# Altium schematic sheet VAC_Sense.SchDoc (part 2 of 3)
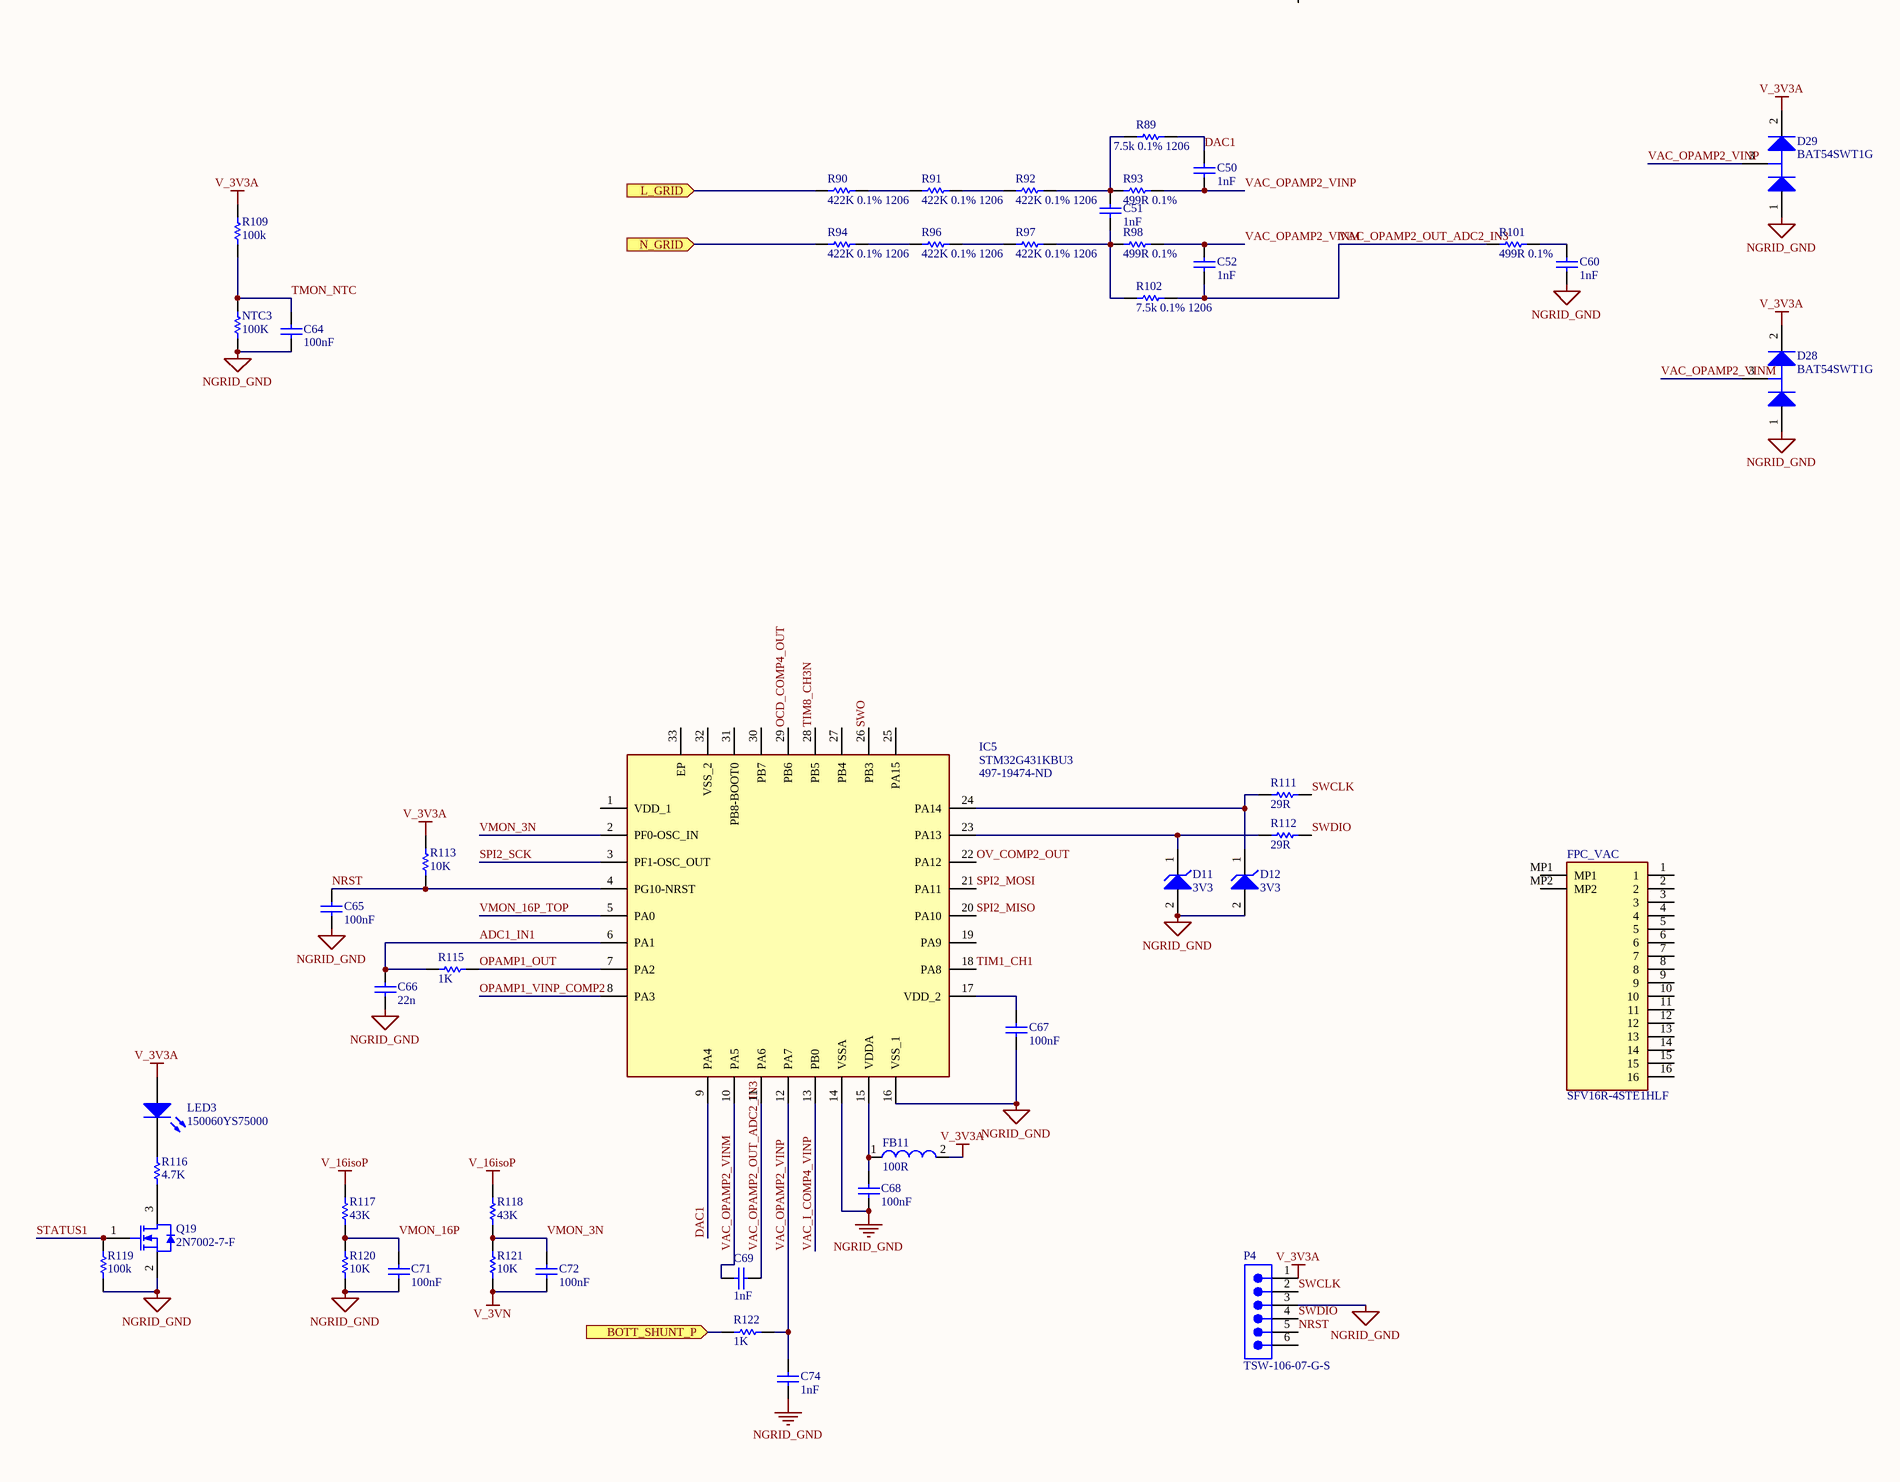
[diagram p2: VAC_Sense.SchDoc, bottom]
## Library data of the parts
C10 = CMP-2007-03234-1: SMD Multilayer Ceramic Capacitor, 1 µF, 25 V, 0805 [2012 Metric], ± 10%, X7R; Part Number: C0805C105K3RACTU; Manufacturer: Kemet; Voltage Rating: 25V; Supplier 1: Digi-Key; Supplier Part Number 1: 399-8004-1-ND; Manufacturer Part Number: C0805C105K3RACTU; RoHS: Yes; Category: Ceramic Capacitors; Stock 1: 73815; Pricing 1: 1=0.14000, 10=0.09900, 50=0.05620, 100=0.04650, 500=0.03262, 1000=0.02700 (USD); Mount: Surface Mount; Case/Package: 0805; Number of Pins: 2; Case Code (Imperial): 0805; Case Code (Metric): 2012; Dielectric Material: Ceramic; Contact Plating: Tin,Matte; Min Operating Temperature: -55°C; Max Operating Temperature: 125°C; Capacitance: 1uF; Tolerance: 10%; Packaging: Tape and Reel; Dielectric: X7R; Package Quantity: 1; Voltage Rating (DC): 25V; Termination: SMD/SMT; Series: C; Construction: Flat; Voltage: 25V; Length: 2mm; Width: 0.049inch; Height: 1.25mm; Depth: 1.25mm; Thickness: 0.055inch; Radiation Hardening: No; RoHS Compliant: Yes; REACH SVHC: No SVHC; ComponentLink1URL: https://datasheet.ciiva.com/6074/kem-c1002-x7r-smd-6074661.pdf?src-supplier=Farnell; ComponentLink1Description: https://datasheet.ciiva.com/6074/kem-c1002-x7r-smd-6074661.pdf?src-supplier=Farnell; ComponentLink2URL: https://datasheet.ciiva.com/28610/1918693-28610874.pdf?src-supplier=Element14; ComponentLink2Description: https://datasheet.ciiva.com/28610/1918693-28610874.pdf?src-supplier=Element14; ComponentLink3URL: https://datasheet.ciiva.com/46443/1851736-46443533.pdf?src-supplier=Element14; ComponentLink3Description: https://datasheet.ciiva.com/46443/1851736-46443533.pdf?src-supplier=Element14
C42 C101 = CMP-2000-06039-1: Chip Capacitor, 4.7 uF, +/- 10%, 25 V, -55 to 125 degC, 0805 (2012 Metric), RoHS, Tape and Reel; Manufacturer: TDK; PCN Part Number: MLCCPartNumberChange30/Nov/2012; Other Names: 445-5972-2C2012X7R1E475KC2012X7R1E475KT000N; Temperature Coefficient: X7R; Voltage - Rated: 25V; Product Training Modules: CSeriesGeneralApplicationsSEAT,CCV,andTVCLDesignToolsGuidetoReplacinganElectrolyticCapacitorwithanMLCC; Catalog Drawings: CSERIES_2012-0805_1.45; Online Catalog: CSeries,GeneralPurpose; Capacitance: 4.7µF; Package Description: 2-Pin Surface Mount Device, Body 2 x 1.25 mm; Manufacturer URL: http://www.tdk.com/; Features: -; Family: CeramicCapacitors; Applications: GeneralPurpose; Standard Package: 2,000; RoHS Information: RoHSCertificate-MLCC; Operating Temperature: -55°C~125°C; Lead Spacing: -; Lead Style: -; Datasheet Version: 01/2016; Datasheet URL: https://product.tdk.com/info/en/documents/chara_sheet/C2012X7R1E475K125AB.pdf; Series: C; Package Reference: 0805; Category: Capacitors; Ratings: -; Packaging: Tape&Reel(TR); Tolerance: ±10%; Height - Seated (Max): -; Size / Dimension: 0.079"Lx0.049"W(2.00mmx1.25mm); Package / Case: 0805(2012Metric); Mounting Technology: SurfaceMount; Mounting Type: SurfaceMount,MLCC; Thickness (Max): 0.057"(1.45mm)
C43 = CMP-2000-05863-1: Chip Capacitor, 10 uF, +/- 10%, 25 V, -55 to 85 degC, 1206 (3216 Metric), RoHS, Tape and Reel; Manufacturer: AVX; Dielectric: X5R; Capacitance: 10µF; Mounting Technology: SurfaceMount; Package Reference: 1206; Tolerance (%): ±10%; Manufacturer URL: http://www.avx.com/; Rated Voltage: 25V; Datasheet URL: http://datasheets.avx.com/cx5r.pdf; Package Description: 2-Pin Surface Mount Device, Body 3.2 x 1.6 mm; Datasheet Version: 05/2016; Case Size/Dimension: 1206
C50-C60 C64 C65 C69 C71 C72 C74 = CMP-2006-04245-1: Manufacturer: AVX Interconnect / Elco; Part Number: 06035A151JAT2A.; Manufacturer Part Number: 06035A151JAT2A; Dielectric Material: Ceramic; Capacitance: 100pF; Tolerance: 5%; Voltage Rating (DC): 50V; Dielectric: C0G; Temperature Coefficient: 30ppm/°C; Insulation Resistance: 100GR; Supplier 1: Digi-Key; Supplier Part Number 1: 478-1177-1-ND; RoHS: Yes; Category: Ceramic Capacitors; Stock 1: 63714; Pricing 1: 1=0.12000, 10=0.08900, 100=0.04180, 500=0.02932, 1000=0.02428 (USD); Mount: Surface Mount,PCB; Case/Package: 0603; Number of Pins: 2; Case Code (Metric): 1608; Case Code (Imperial): 0603; Contact Plating: Tin,Matte; Min Operating Temperature: -55°C; Max Operating Temperature: 125°C; Voltage Rating: 50V; Packaging: Tape and Reel; Package Quantity: 1; Termination: SMD/SMT; Voltage: 50V; Length: 1.6mm; Height: 0.86mm; Width: 0.032inch; Depth: 0.81mm; Thickness: 0.035inch; Radiation Hardening: No; Lead Free: Lead Free; REACH SVHC: No SVHC; ComponentLink1URL: https://datasheet.ciiva.com/1124/84496-1124721.pdf?src-supplier=Element14; ComponentLink1Description: https://datasheet.ciiva.com/1124/84496-1124721.pdf?src-supplier=Element14; ComponentLink2URL: https://datasheet.ciiva.com/2987/ccog-2987781.pdf?src-supplier=Avnet; ComponentLink2Description: https://datasheet.ciiva.com/2987/ccog-2987781.pdf?src-supplier=Avnet; ComponentLink3URL: https://datasheet.ciiva.com/7855/759117-7855061.pdf?src-supplier=Element14; ComponentLink3Description: https://datasheet.ciiva.com/7855/759117-7855061.pdf?src-supplier=Element14; ComponentLink4URL: https://datasheet.ciiva.com/2987/ccog-2987782.pdf?src-supplier=Avnet; ComponentLink4Description: https://datasheet.ciiva.com/2987/ccog-2987782.pdf?src-supplier=Avnet; ComponentLink5URL: https://datasheet.ciiva.com/156/ccog-156216.pdf?src-supplier=Digi-Key; ComponentLink5Description: https://datasheet.ciiva.com/156/ccog-156216.pdf?src-supplier=Digi-Key; ComponentLink6URL: https://datasheet.ciiva.com/156/ccog-156217.pdf?src-supplier=Digi-Key; ComponentLink6Description: https://datasheet.ciiva.com/156/ccog-156217.pdf?src-supplier=Digi-Key; ComponentLink7URL: https://datasheet.ciiva.com/156/ccog-156218.pdf?src-supplier=Digi-Key; ComponentLink7Description: https://datasheet.ciiva.com/156/ccog-156218.pdf?src-supplier=Digi-Key; ComponentLink8URL: https://datasheet.ciiva.com/16300/ccog-16300429.pdf?src-supplier=Future+Electronics; ComponentLink8Description: https://datasheet.ciiva.com/16300/ccog-16300429.pdf?src-supplier=Future+Electronics; ComponentLink9URL: https://datasheet.ciiva.com/22699/84496-22699966.pdf?src-supplier=Element14; ComponentLink9Description: https://datasheet.ciiva.com/22699/84496-22699966.pdf?src-supplier=Element14; ComponentLink10URL: https://datasheet.ciiva.com/5418/ccog-5418335.pdf?src-supplier=Mouser; ComponentLink10Description: https://datasheet.ciiva.com/5418/ccog-5418335.pdf?src-supplier=Mouser; ComponentLink11URL: https://datasheet.ciiva.com/16538/ccog-16538111.pdf?src-supplier=Avnet+Asia; ComponentLink11Description: https://datasheet.ciiva.com/16538/ccog-16538111.pdf?src-supplier=Avnet+Asia
C66 C75 = CMP-2100-03644-1: Chip Capacitor, 0.1 uF, +/- 10%, 50 V, -55 to 125 degC, 0805 (2012 Metric), RoHS, Tape and Reel; Manufacturer: Murata; Manufacturer Part Number: GRM21BR71H104KA01L; Voltage: 50V; Capacitance: 100nF; Insulation Resistance: 10GR; Dielectric Material: Ceramic; Dielectric: X7R; Package Description: 2-Pin Surface Mount Device, Body 2 x 1.25 mm; Manufacturer URL: http://www.murata.com/; Case Code (Imperial): 0805; Datasheet URL: http://psearch.en.murata.com/capacitor/product/GRM21BR71H104KA01%23.pdf; Termination: SMD/SMT; Lead Free: LeadFree; Package Quantity: 1; Mount: SurfaceMount; REACH SVHC: Unknown; Thickness: 0.053inch; Height: 1.25mm; Case/Package: 0805; Voltage Rating: 50V; Width: 0.049inch; Case Code (Metric): 2012; Material: Ceramic; Min Operating Temperature: -55degC; RoHSCompliant: true; Datasheet Version: 42675.0; Voltage Rating (DC): 50V; Tolerance: 10%; Package Reference: 0805; Depth: 1.25mm; Length: 2mm; Max Operating Temperature: 125degC; Packaging: TapeandReel; Number of Pins: 2; Radiation Hardening: No; Supplier 1: Farnell; Supplier Part Number 1: 2408531; RoHS: Yes; Category: Ceramic Capacitors; ComponentLink1URL: https://datasheet.ciiva.com/11786/0900766b8003061f-11786305.pdf?src-supplier=RSComponents; ComponentLink1Description: https://datasheet.ciiva.com/11786/0900766b8003061f-11786305.pdf?src-supplier=RSComponents; ComponentLink2URL: https://datasheet.ciiva.com/20173/71-2024-20173169.pdf?src-supplier=Rapid+Electronics; ComponentLink2Description: https://datasheet.ciiva.com/20173/71-2024-20173169.pdf?src-supplier=Rapid+Electronics; ComponentLink3URL: https://datasheet.ciiva.com/29200/453120-da-01-en-vs-kondensator-0805-29200537.pdf?src-supplier=Conrad; ComponentLink3Description: https://datasheet.ciiva.com/29200/453120-da-01-en-vs-kondensator-0805-29200537.pdf?src-supplier=Conrad; ComponentLink4URL: https://datasheet.ciiva.com/132/partnumbering-e-01-132209.pdf?src-supplier=Digi-Key; ComponentLink4Description: https://datasheet.ciiva.com/132/partnumbering-e-01-132209.pdf?src-supplier=Digi-Key; ComponentLink5URL: https://datasheet.ciiva.com/132/partnumbering-e-01-132210.pdf?src-supplier=Digi-Key; ComponentLink5Description: https://datasheet.ciiva.com/132/partnumbering-e-01-132210.pdf?src-supplier=Digi-Key; ComponentLink6URL: https://datasheet.ciiva.com/132/partnumbering-e-01-132211.pdf?src-supplier=Digi-Key; ComponentLink6Description: https://datasheet.ciiva.com/132/partnumbering-e-01-132211.pdf?src-supplier=Digi-Key; ComponentLink7URL: https://datasheet.ciiva.com/7937/1794405-7937708.pdf?src-supplier=Element14; ComponentLink7Description: https://datasheet.ciiva.com/7937/1794405-7937708.pdf?src-supplier=Element14; ComponentLink8URL: https://datasheet.ciiva.com/7937/1794405-7937709.pdf?src-supplier=Element14; ComponentLink8Description: https://datasheet.ciiva.com/7937/1794405-7937709.pdf?src-supplier=Element14; ComponentLink9URL: https://datasheet.ciiva.com/28534/1769893-28534317.pdf?src-supplier=Element14; ComponentLink9Description: https://datasheet.ciiva.com/28534/1769893-28534317.pdf?src-supplier=Element14; ComponentLink10URL: https://datasheet.ciiva.com/7937/4360-7937710.pdf?src-supplier=Element14; ComponentLink10Description: https://datasheet.ciiva.com/7937/4360-7937710.pdf?src-supplier=Element14
  C66: Stock 1: 555000
  C75: Stock 1: 576000
C67 C68 C87-C89 C100 = CMP-2000-05332-1: Cap Ceramic 0.1uF 50VDC X7R 10% SMD 0603 Paper T/R; Manufacturer: Samsung Electro-Mechanics; Manufacturer Part Number: CL10B104KB8NNNC; Capacitance: 0.1µF; Rated Voltage: 50V; Case Size/Dimension: 0603; Datasheet URL: https://datasheet.ciiva.com/29198/456651-da-01-en-vs-kondensator-0605-29198839.pdf; Manufacturer URL: http://www.samsungsem.com/global/index.jsp; Dielectric: X7R; Tolerance (%): ±10%; Datasheet Version: Nov-10; Supplier 1: Digi-Key; Supplier Part Number 1: 1276-1000-1-ND; RoHS: Yes; Category: Ceramic Capacitors; Stock 1: 13409690; Pricing 1: 1=0.10000, 10=0.03000, 50=0.01620, 100=0.01330, 500=0.00950, 1000=0.00746 (USD); Mount: Surface Mount; Case/Package: 0603; Case Code (Metric): 1608; Case Code (Imperial): 0603; Contact Plating: Tin; Material: Ceramic; Min Operating Temperature: -55°C; Max Operating Temperature: 125°C; Voltage Rating: 50V; Package Quantity: 1; Packaging: Tape and Reel; Tolerance: 10%; Voltage Rating (DC): 50V; Voltage: 50V; Series: CL; Construction: Flat; Length: 1.6mm; Width: 0.031inch; Height: 0.8mm; Depth: 0.8mm; Thickness: 0.035inch; Radiation Hardening: No; Lead Free: Lead Free; RoHS Compliant: Yes; ComponentLink1URL: https://datasheet.ciiva.com/25803/cl10b104kb8nnnc-25803393.pdf?src-supplier=Digi-Key; ComponentLink1Description: https://datasheet.ciiva.com/25803/cl10b104kb8nnnc-25803393.pdf?src-supplier=Digi-Key; ComponentLink2URL: https://datasheet.ciiva.com/26838/getdatasheetpartid-89097-26838411.pdf?src-supplier=Verical; ComponentLink2Description: https://datasheet.ciiva.com/26838/getdatasheetpartid-89097-26838411.pdf?src-supplier=Verical; ComponentLink3URL: https://datasheet.ciiva.com/29198/456651-da-01-en-vs-kondensator-0605-29198839.pdf?src-supplier=Conrad; ComponentLink3Description: https://datasheet.ciiva.com/29198/456651-da-01-en-vs-kondensator-0605-29198839.pdf?src-supplier=Conrad
C73 = CMP-2006-02595-1: 0603 100pF 50V ±5 % Tolerance C0G SMT Multilayer Ceramic Capacitor; Part Number: GRM1885C1H101JA01D; Manufacturer: Murata; Tolerance: 5%; Temperature Coefficient: 30ppm/°C; Insulation Resistance: 10GR; Supplier 1: Digi-Key; Supplier Part Number 1: 490-1427-1-ND; Manufacturer Part Number: GRM1885C1H101JA01D; RoHS: Yes; Category: Ceramic Capacitors; Stock 1: 416176; Pricing 1: 1=0.10000, 10=0.06100, 50=0.03320, 100=0.02700, 500=0.01932, 1000=0.01518 (USD); Mount: Surface Mount; Case/Package: 0603; Number of Pins: 2; Case Code (Metric): 1608; Case Code (Imperial): 0603; Dielectric Material: Ceramic; Material: Ceramic; Weight: 7.1E-05oz; Min Operating Temperature: -55°C; Max Operating Temperature: 125°C; Capacitance: 100pF; Voltage Rating: 50V; Packaging: Tape and Reel; Package Quantity: 1; Voltage Rating (DC): 50V; Dielectric: C0G; Termination: SMD/SMT; Voltage: 50V; Length: 1.6mm; Width: 0.031inch; Height: 0.8mm; Thickness: 0.035inch; Depth: 0.8mm; Radiation Hardening: No; REACH SVHC: Unknown; RoHS Compliant: Yes; Lead Free: Lead Free; ComponentLink1URL: https://datasheet.ciiva.com/131/product-131088.pdf?src-supplier=Digi-Key; ComponentLink1Description: https://datasheet.ciiva.com/131/product-131088.pdf?src-supplier=Digi-Key; ComponentLink2URL: https://datasheet.ciiva.com/18100/getdatasheetpartid-26823-18100641.pdf?src-supplier=Verical; ComponentLink2Description: https://datasheet.ciiva.com/18100/getdatasheetpartid-26823-18100641.pdf?src-supplier=Verical; ComponentLink3URL: https://datasheet.ciiva.com/3777/grm1885c1h101ja0123-3777264.pdf?src-supplier=Arrow+Electronics; ComponentLink3Description: https://datasheet.ciiva.com/3777/grm1885c1h101ja0123-3777264.pdf?src-supplier=Arrow+Electronics; ComponentLink4URL: https://datasheet.ciiva.com/29149/450134-da-01-en-vs-kondensator-0603-29149008.pdf?src-supplier=Conrad; ComponentLink4Description: https://datasheet.ciiva.com/29149/450134-da-01-en-vs-kondensator-0603-29149008.pdf?src-supplier=Conrad; ComponentLink5URL: https://datasheet.ciiva.com/131/partnumbering-e-01-131089.pdf?src-supplier=Digi-Key; ComponentLink5Description: https://datasheet.ciiva.com/131/partnumbering-e-01-131089.pdf?src-supplier=Digi-Key; ComponentLink6URL: https://datasheet.ciiva.com/11605/c02e-11605557.pdf?src-supplier=Avnet; ComponentLink6Description: https://datasheet.ciiva.com/11605/c02e-11605557.pdf?src-supplier=Avnet; ComponentLink7URL: https://datasheet.ciiva.com/28556/4360-28556551.pdf?src-supplier=Element14; ComponentLink7Description: https://datasheet.ciiva.com/28556/4360-28556551.pdf?src-supplier=Element14; ComponentLink8URL: https://datasheet.ciiva.com/7828/4360-7828889.pdf?src-supplier=Element14; ComponentLink8Description: https://datasheet.ciiva.com/7828/4360-7828889.pdf?src-supplier=Element14; ComponentLink9URL: https://datasheet.ciiva.com/7828/4360-7828890.pdf?src-supplier=Element14; ComponentLink9Description: https://datasheet.ciiva.com/7828/4360-7828890.pdf?src-supplier=Element14; ComponentLink10URL: https://datasheet.ciiva.com/7828/4360-7828891.pdf?src-supplier=Element14; ComponentLink10Description: https://datasheet.ciiva.com/7828/4360-7828891.pdf?src-supplier=Element14; ComponentLink11URL: https://datasheet.ciiva.com/14116/grmseries-tc-hitype-eng-14116828.pdf?src-supplier=Distrelec; ComponentLink11Description: https://datasheet.ciiva.com/14116/grmseries-tc-hitype-eng-14116828.pdf?src-supplier=Distrelec; ComponentLink12URL: https://datasheet.ciiva.com/16291/product-16291613.pdf?src-supplier=Future+Electronics; ComponentLink12Description: https://datasheet.ciiva.com/16291/product-16291613.pdf?src-supplier=Future+Electronics; ComponentLink13URL: https://datasheet.ciiva.com/131/partnumbering-e-01-131087.pdf?src-supplier=Digi-Key; ComponentLink13Description: https://datasheet.ciiva.com/131/partnumbering-e-01-131087.pdf?src-supplier=Digi-Key; ComponentLink14URL: https://datasheet.ciiva.com/14116/grmseries-tc-hitype-eng-14116815.pdf?src-supplier=Distrelec; ComponentLink14Description: https://datasheet.ciiva.com/14116/grmseries-tc-hitype-eng-14116815.pdf?src-supplier=Distrelec
D11 D12 = CMP-1063-00098-1: Transient Voltage Suppressor, Micro-Packaged Diode for ESD Protection, 2-Pin SOD-523, Pb-Free, Tape and Reel; Manufacturer: On Semiconductor; PartNumber: ESD5Z3.3T1G; VRWM Max (V): 3.3; Number of Lines: 1; V(BR) Min (V): 5; PPK Max (W): 158; Direction: Unidirectional; IR Max (uA): 0.05; PackageReference: SOD-523-2-502-01; PackageVersion: Rev. E, 09/2010; RoHS: Pb-Free; ComponentLink3Description: Package Specification; Packing: Tape and Reel; ComponentLink1URL: http://www.onsemi.com/; DatasheetVersion: Rev. 10; ComponentLink2Description: Datasheet; Mounting Technology: Surface Mount; ComponentLink2URL: http://www.onsemi.cn/pub_link/Collateral/ESD5Z2.5T1-D.PDF; PackageDescription: 2-Pin SOD, Body 1.2 x 0.8 mm; ComponentLink3URL: http://www.onsemi.com/pub_link/Collateral/502-01.PDF; ComponentLink1Description: Manufacturer URL
D25 D28 D29 = CMP-1055-00559-1: Dual Series Schottky Barrier Diodes, 3-Pin SOT-323, Pb-Free, Tape and Reel; Manufacturer: On Semiconductor; trr Max (ns): 5; IFSM Max (A): 0.6; ComponentLink1URL: http://www.onsemi.com/; Mounting Technology: Surface Mount; ComponentLink1Description: Manufacturer URL; ComponentLink3URL: http://www.onsemi.com/pub_link/Collateral/419-04.PDF; RoHS: TRUE; PackageVersion: Rev. N, 11/2008; Packing: Tape and Reel; PackageReference: SOT-323-3-419-04; ComponentLink2URL: http://www.onsemi.cn/pub_link/Collateral/BAT54SWT1-D.PDF; ComponentLink3Description: Package Specification; PackageDescription: 3-Pin Small Outline Transistor, Body 2 x 1.25 mm, Pitch 0.65 mm; ComponentLink2Description: Datasheet; PartNumber: BAT54SWT1G; DatasheetVersion: Rev. 10; Configuration: Dual
FB3-FB5 FB11 FB13 = CMP-0220-00115-1: SMD EMI Suppression Ferrite Bead WE-CBF, Z = 1500 Ohm; DatasheetVersion: Dec-2005; ComponentLink1URL: http://www.we-online.com; PackageVersion: 2009; PackageDescription: Chip Inductor, 2-Leads, Body 1.6 x 0.8 mm; ComponentLink2URL: http://www.we-online.de/katalog/media/pdf/742792691.pdf; ComponentLink1Description: Manufacturer Link; ComponentLink2Description: Datasheet; Impedance: 1500 Ohm; PackageReference: SMD-0603
FPC_VAC = SFV16R-4STE1HLF: Connector; Manufacturer_Name: Amphenol; Datasheet Link: https://cdn.amphenol-icc.com/media/wysiwyg/files/documentation/gs-12-645.pdf; Height: 2mm; Manufacturer_Part_Number: SFV16R-4STE1HLF; Mouser Part Number: 649-SFV16R-4STE1HLF; Mouser Price/Stock: https://www.mouser.com/Search/Refine.aspx?Keyword=649-SFV16R-4STE1HLF
IC4 = MIC2290YML_TR: Integrated Circuit; Manufacturer_Name: Microchip; Manufacturer_Part_Number: MIC2290YML TR; Datasheet Link: http://ww1.microchip.com/downloads/en/DeviceDoc/mic2290.pdf; Height: 0.95mm; Arrow Part Number: MIC2290YML TR; Arrow Price/Stock: https://www.arrow.com/en/products/mic2290yml-tr/microchip-technology
IC5 = STM32G431KBU3: Microcontroller 32-Bit ARM Cortex-M4 RISC 128KB Flash 1.71V to 3.6V 32-Pin UFQFPN; Manufacturer_Name: STMicroelectronics; Manufacturer Part Number: STM32G431KBU6; Datasheet Link: https://componentsearchengine.com/Datasheets/1/STM32G431KBU3.pdf; Height: 0.6mm; Manufacturer_Part_Number: STM32G431KBU3; Mouser Part Number: 511-STM32G431KBU3; Mouser Price/Stock: https://www.mouser.co.uk/ProductDetail/STMicroelectronics/STM32G431KBU3?qs=PzGy0jfpSMtowkKWTRQBRw%3D%3D; Arrow Part Number: STM32G431KBU3; Arrow Price/Stock: https://www.arrow.com/en/products/stm32g431kbu3/stmicroelectronics; Supplier 1: Digi-Key; Manufacturer: STMicroelectronics; RoHS: No; Category: Microcontrollers; Stock 1: 293; Pricing 1: 1=5.78000, 10=5.18800, 25=4.90440, 80=4.25038, 230=4.03239, 490=3.61827, 980=3.17870 (USD)
L4 = CMP-0007-00012-1: Semi-shielded Power Inductor, 15 uH, +/- 20%, 0.8 A, -40 to 125 degC, 3 x 3 x 1.5 mm SMD, RoHS and Halogen Free, Tape and Reel; Manufacturer: Bourns; Isat: 0.68 A; Resistance to Solder Heat: +260 degC for 10 sec.; Inductance tolerance: +/- 20%; Rated current: 0.8 A; DCR Max: 0.422 Ohm; SRF Min: 33 MHz; Inductance: 15 uH; Core Material: Ferrite; Material: Steel; Max DC Current: 800mA; DC Resistance (DCR): 422mR; Self Resonant Frequency: 33MHz; Saturation Current: 680mA; Test Frequency: 1MHz; ComponentLink3Description: Package Specification; ComponentLink2URL: http://www.bourns.com/data/global/pdfs/SRN3015.pdf; Mounting Technology: Surface Mount; Operating Temperature: -40 to 125 degC; PartNumber: SRN3015-150M; ComponentLink1URL: http://www.bourns.com/; PackageReference: SRN3015; ComponentLink1Description: Manufacturer URL; PackageDescription: 2-Pin SMD, Body 3 x 3 mm, Height 1.5 mm; Packing: Tape and Reel; RoHS: TRUE; ComponentLink2Description: Datasheet; DatasheetVersion: Aug-11; ComponentLink3URL: http://www.bourns.com/data/global/pdfs/SRN3015.pdf; Supplier 1: Digi-Key; Supplier Part Number 1: SRN3015-150MCT-ND; Manufacturer Part Number: SRN3015-150M; Category: Fixed Inductors; Stock 1: 84; Pricing 1: 1=0.49000, 10=0.42400, 25=0.39400, 50=0.33360, 100=0.30320, 250=0.28500, 500=0.25468, 1000=0.20617 (USD); Case/Package: 1212; Number of Pins: 2; Weight: 0.001235oz; Min Operating Temperature: -40°C; Max Operating Temperature: 125°C; Package Quantity: 2000; Packaging: Tape and Reel; Termination: SMD/SMT; Tolerance: 20%; Shielding: Shielded; Current Rating: 800mA; Series: SRN3015; RMS Current (Irms): 800mA; Resistor Type: Wirewound; DC Current: 800mA; Frequency: 33MHz; Sample Rate (Hz): 1MHz; Length: 3mm; Width: 3mm; Height: 1.5mm; Height - Seated (Max): 0.059inch; Depth: 3.1mm; REACH SVHC: No SVHC; RoHS Compliant: Yes; Military Standard: Not; ComponentLink4URL: https://datasheet.ciiva.com/11802/0900766b80fe1f40-11802572.pdf?src-supplier=RSComponents; ComponentLink4Description: https://datasheet.ciiva.com/11802/0900766b80fe1f40-11802572.pdf?src-supplier=RSComponents; ComponentLink5URL: https://datasheet.ciiva.com/7849/1481208-7849509.pdf?src-supplier=Element14; ComponentLink5Description: https://datasheet.ciiva.com/7849/1481208-7849509.pdf?src-supplier=Element14; ComponentLink6URL: https://datasheet.ciiva.com/30224/587srn3015-30224969.pdf?src-supplier=Onlinecomponents.com; ComponentLink6Description: https://datasheet.ciiva.com/30224/587srn3015-30224969.pdf?src-supplier=Onlinecomponents.com; ComponentLink7URL: https://datasheet.ciiva.com/1048/srn3015-1048842.pdf?src-supplier=Digi-Key; ComponentLink7Description: https://datasheet.ciiva.com/1048/srn3015-1048842.pdf?src-supplier=Digi-Key; ComponentLink8URL: https://datasheet.ciiva.com/1048/srn3015-1048843.pdf?src-supplier=Digi-Key; ComponentLink8Description: https://datasheet.ciiva.com/1048/srn3015-1048843.pdf?src-supplier=Digi-Key; ComponentLink9URL: https://datasheet.ciiva.com/5986/1481208-5986171.pdf?src-supplier=Farnell; ComponentLink9Description: https://datasheet.ciiva.com/5986/1481208-5986171.pdf?src-supplier=Farnell; ComponentLink10URL: https://datasheet.ciiva.com/1048/srn3015-1048844.pdf?src-supplier=Digi-Key; ComponentLink10Description: https://datasheet.ciiva.com/1048/srn3015-1048844.pdf?src-supplier=Digi-Key; ComponentLink11URL: https://datasheet.ciiva.com/8515/srn3015-8515454.pdf?src-supplier=Avnet; ComponentLink11Description: https://datasheet.ciiva.com/8515/srn3015-8515454.pdf?src-supplier=Avnet; ComponentLink12URL: https://datasheet.ciiva.com/28678/1481208-28678223.pdf?src-supplier=Element14; ComponentLink12Description: https://datasheet.ciiva.com/28678/1481208-28678223.pdf?src-supplier=Element14
LED3 = CMP-1426-00005-1: SMD mono-color Chip LED, WL-SMCW, Yellow; Manufacturer: Wuerth Elektronik; Dominant Wavelength: 590nm; Viewing Angle: 140°; Lens Style: Clear,Rectangular; Luminous Intensity: 120mcd; Forward Voltage: 2V; Forward Current: 30mA; Test Current: 20mA; ComponentLink1URL: http://www.we-online.com; PartNumber: 150060YS75000; Color: Yellow; ComponentLink2Description: Datasheet; ComponentLink2URL: http://katalog.we-online.com/led/datasheet/150060YS75000.pdf; ComponentLink1Description: Manufacturer URL; PackageReference: 0603_A; Supplier 1: Digi-Key; Supplier Part Number 1: 732-4981-1-ND; Manufacturer Part Number: 150060YS75000; RoHS: Yes; Category: LEDs; Stock 1: 139; Pricing 1: 1=0.14000, 50=0.13300, 100=0.11400, 500=0.09900 (USD); Mount: Surface Mount; Case/Package: 0603; Case Code (Imperial): 0603; Case Code (Metric): 1608; Min Operating Temperature: -40°C; Max Operating Temperature: 85°C; Packaging: Tape and Reel; Package Quantity: 4000; Wavelength: 590nm; Length: 1.6mm; Height: 0.7mm; Width: 0.8mm; REACH SVHC: Unknown; ComponentLink3URL: https://datasheet.ciiva.com/23843/150060ys75000-23843250.pdf?src-supplier=Newark; ComponentLink3Description: https://datasheet.ciiva.com/23843/150060ys75000-23843250.pdf?src-supplier=Newark; ComponentLink4URL: https://datasheet.ciiva.com/29279/759432-da-01-en-chipled-0603-w-kl-gelb-150060ys75000-29279206.pdf?src-supplier=Conrad; ComponentLink4Description: https://datasheet.ciiva.com/29279/759432-da-01-en-chipled-0603-w-kl-gelb-150060ys75000-29279206.pdf?src-supplier=Conrad; ComponentLink5URL: https://datasheet.ciiva.com/29563/150060ys75000-29563045.pdf?src-supplier=Digi-Key; ComponentLink5Description: https://datasheet.ciiva.com/29563/150060ys75000-29563045.pdf?src-supplier=Digi-Key; ComponentLink6URL: https://datasheet.ciiva.com/22656/1911348-22656951.pdf?src-supplier=Element14; ComponentLink6Description: https://datasheet.ciiva.com/22656/1911348-22656951.pdf?src-supplier=Element14; ComponentLink7URL: https://datasheet.ciiva.com/29563/150060ys75000-29563033.pdf?src-supplier=Digi-Key; ComponentLink7Description: https://datasheet.ciiva.com/29563/150060ys75000-29563033.pdf?src-supplier=Digi-Key; ComponentLink8URL: https://datasheet.ciiva.com/48430/150060ys75000-eng-tds-48430044.pdf?src-supplier=Distrelec; ComponentLink8Description: https://datasheet.ciiva.com/48430/150060ys75000-eng-tds-48430044.pdf?src-supplier=Distrelec
NTC3 = CMP-2000-03662-1: Manufacturer: Vishay Dale; Part Number: NTHS0603N01N1003JE
P4 = CMP-1024-00383-1: 0.025" SQ Post Header, Through-hole, Vertical, -55 to 125 degC, 2.54 mm Pitch, 6-Pin, Male, RoHS; Manufacturer: Samtec; Pitch: 2.54 mm; RoHS: True; ComponentLink1Description: Manufacturer URL; DatasheetVersion: F-214; Orientation: Vertical; ComponentLink1URL: http://www.samtec.com; ComponentLink3Description: Package Specification; ComponentLink2Description: Datasheet; PackageVersion: DM, 8/1988; PackageDescription: .025[0.64] SQ. Post Terminal Strip Assembly; PackageReference: TSW-106-07-X-S; Mounting Technology: Through-hole; Temperature Range: -55 to 125 degC; ComponentLink3URL: http://www.samtec.com/documents/webfiles/cpdf/TSW-XXX-XX-XXX-X-XX-XXX-MKT.pdf; ComponentLink2URL: http://www.samtec.com/documents/webfiles/pdf/TSW_TH.PDF; PartNumber: TSW-106-07-G-S
Q6 = CMP-2000-06730-1: NPN General-Purpose Amplifier, 0.6 A, 40 V, -55 to 150 degC, 3-Pin SOT-23, RoHS, Tape and Reel; Collector- Base Voltage VCBO: 60V; Collector- Emitter Voltage VCEO Max: 40V; DC Collector/Base Gain hfe Min: 100; Collector-Emitter Saturation Voltage: 0.75V; Maximum Power Dissipation: 350mW; Unit Weight: 0.002116oz; Configuration: Single; Emitter- Base Voltage VEBO: 6V; Brand: FairchildSemiconductor; Maximum DC Collector Current: 0.6A; Package Version: Rev. 12, 03/2016; DC Current Gain hFE Max: 300; Gain Bandwidth Product fT: 250MHz; Factory Pack Quantity: 3000; Product Category: BipolarTransistors-BJT; Packaging: Reel; Datasheet URL: https://www.fairchildsemi.com/datasheets/2N/2N4401.pdf; Transistor Polarity: NPN; Mounting Style: SMD/SMT; Manufacturer URL: https://www.fairchildsemi.com/; Package Description: 3-Pin Small Outline Transistor, Body 2.92 x 1.325 mm, Pitch 0.95 mm; Maximum Operating Temperature: +150C; Minimum Operating Temperature: -55C; Package Reference: SOT23-3; RoHS: Details; Datasheet Version: Rev. 1.1.0, 11/2014; Series: MMBT4401; Package URL: http://www.fairchildsemi.com/dwg/MA/MA03D.pdf; Package / Case: SOT-23; Mounting Technology: SurfaceMount; Manufacturer: FairchildSemiconductor
Q9 = CMP-1048-00392-1: Complementary General Purpose Transistors, 6-Pin SC70, Pb-Free, Tape and Reel; Manufacturer: On Semiconductor; IC Continuous (A): 0.2; Packing: Tape and Reel; ComponentLink2URL: http://www.onsemi.com/pub_link/Collateral/MBT3946DW1T1-D.PDF; Mounting Technology: Surface Mount; PackageDescription: 6-Pin Small Outline Transistor, Body 2 x 1.25 mm, Pitch 0.65 mm; ComponentLink1URL: http://www.onsemi.com/; Polarity: Complementary; RoHS: TRUE; ComponentLink1Description: Manufacturer URL; ComponentLink3Description: Package Specification; DatasheetVersion: Rev. 7; PackageReference: SC70-6-419B-02_W; ComponentLink2Description: Datasheet; PackageVersion: Rev. W; PartNumber: MBT3946DW1T2G; ComponentLink3URL: http://www.onsemi.com/pub_link/Collateral/SMF05C-D.PDF
Q10 = CMP-2000-05568-2: MOSFET N-CH 60V 115MA SOT323; Element Configuration: Single; Nominal Vgs: 2V; Drain to Source Breakdown Voltage: 70V; Drain to Source Resistance: 2.6R; Input Capacitance: 50pF; On-State Resistance: 7.5R; Number of Channels: 1; Power Dissipation: 200mW; Turn-Off Delay Time: 11ns; Turn-On Delay Time: 7ns; Gate to Source Voltage (Vgs): 20V; Dual Supply Voltage: 60V; Contact Plating: Tin; Min Operating Temperature: -55°C; Radiation Hardening: No; Drain to Source Voltage (Vdss): 60V; Height: 1mm; Max Operating Temperature: 150°C; Voltage Rating (DC): 60V; Case/Package: SOT-323; Weight: 0.000212oz; Mount: Surface Mount; Length: 2.2mm; Lead Free: Lead Free; Threshold Voltage: 2V; Packaging: Tape and Reel; Max Power Dissipation: 200mW; Package Quantity: 1; Continuous Drain Current (ID): 115mA; Number of Pins: 3; Width: 1.35mm; Current Rating: 115mA; Rds On Max: 7.5R; REACH SVHC: No SVHC; Termination: SMD/SMT; Number of Elements: 1
Q19 = CMP-2000-04929-1: N-Channel Enhancement Mode Field Effect Transistor, 60 V, 0.115 A, -55 to 150 degC, 3-Pin SOT23, RoHS, Tape and Reel; Id - Continuous Drain Current: 115mA; Typical Turn-On Delay Time: 7ns; Typical Turn-Off Delay Time: 11ns; Brand: DiodesIncorporated; Transistor Type: 1N-Channel; Vgs - Gate-Source Voltage: 20V; Rise Time: 3ns; Configuration: Single; Fall Time: 5.6ns; Vds - Drain-Source Breakdown Voltage: 70V; Rds On - Drain-Source Resistance: 7.5Ohms; Number of Channels: 1Channel; Forward Transconductance - Min: 0.08S; Pd - Power Dissipation: 300mW; Unit Weight: 0.000282oz; Datasheet URL: http://datasheet.octopart.com/2N7002-7-F-Diodes-Inc.-datasheet-8326113.pdf; Width: 1.3mm; Series: 2N7002; Length: 2.9mm; Product Category: MOSFET; Minimum Operating Temperature: -55C; Manufacturer URL: http://www.diodes.com/; Mounting Style: SMD/SMT; Package Reference: SOT23-3; Package Description: 3-Pin Small Outline Transistor, Body 2.9 x 1.3 mm, Pitch 0.96 mm; Maximum Operating Temperature: +150C; Transistor Polarity: N-Channel; Factory Pack Quantity: 3000; Technology: Si; Channel Mode: Enhancement; Datasheet Version: Rev. 21-2, 02/2009; Type: EnhancementModeFieldEffectTransistor; RoHS: True; Packaging: Reel; Package / Case: SOT-23-3; Height: 1mm; Product: MOSFETSmallSignal; Manufacturer: DiodesIncorporated
Q? = CMP-0434-00001-1: N-channel 60 V, 1.8 Ohm, 0.35 A STripFET(TM) II Power MOSFET, SOT23; Manufacturer: STMicroelectronics; PartNumber: 2N7002; ComponentLink2Description: Datasheet; ComponentLink2URL: http://www.st.com/st-web-ui/static/active/en/resource/technical/document/datasheet/CD00005134.pdf; ComponentLink1Description: Manufacturer URL; ComponentLink1URL: http://www.st.com/; DatasheetVersion: Rev. 9, 11/2008; PackageReference: SOT-23; Mounting Technology: Surface Mount; PackageDescription: 3-Pin SOT23, 3.016 x 2.8 mm Body, 0.95 mm Pitch
R6 = CMP-2000-06929-1: Chip Resistor, 180 Ohm, +/- 1%, 0.1 W, -55 to 155 degC, 0603 (1608 Metric), RoHS, Tape and Reel; Manufacturer: Yageo; Manufacturer Part Number: RC0603FR-07180RL; Voltage Rating: 50V; Power Rating: 100mW; Resistance: 180Ohms; Temperature Coefficient: 100PPM/C; Package Reference: 0603; Package Description: 2-Pin Surface Mount Device, Body 1.6 x 0.8 mm; Case Code - mm: 1608; Mounting Technology: SurfaceMount; Packaging: Reel; Tolerance: 1%; Manufacturer URL: http://www.yageo.com/; Series: RC; Operating Temperature Range: -55Cto+155C; Product: ThickFilmResistorsGeneralPurpose; Termination Style: SMD/SMT; Case Code - in: 0603; Datasheet Version: Rev. 7, 05/2017; Datasheet URL: http://www.yageo.com/documents/recent/PYu-RC_Group_51_RoHS_L_7.pdf; Supplier 1: Future Electronics; Supplier Part Number 1: 5678388; RoHS: Yes; Category: Chip SMD Resistors; Stock 1: 722469; Pricing 1: 1=0.00940, 50=0.00570, 100=0.00520, 500=0.00430, 1500=0.00370 (USD); Case/Package: 0603; Number of Pins: 2; Case Code (Metric): 1608; Case Code (Imperial): 0603; Size Code: 0603; Min Operating Temperature: -55°C; Max Operating Temperature: 155°C; Resistor Type: Thick Film; Number of Terminations: 2; Termination: SMD/SMT; Max Power Dissipation: 100mW; Package Quantity: 1; Voltage Rating (DC): 50V; Resistance Tolerance: 1%; Features: Moisture Resistant; Construction: Rectangular; Length: 1.6mm; Width: 0.8mm; Height: 0.022inch; Depth: 0.8mm; RoHS Compliant: Yes; REACH SVHC: Unknown; Military Standard: Not; Lead Free: Lead Free; ComponentLink1URL: https://datasheet.ciiva.com/2454/pyu-r-int-thick-7-2454468.pdf?src-supplier=Digi-Key; ComponentLink1Description: https://datasheet.ciiva.com/2454/pyu-r-int-thick-7-2454468.pdf?src-supplier=Digi-Key; ComponentLink2URL: https://datasheet.ciiva.com/2454/pyu-r-int-thick-7-2454469.pdf?src-supplier=Digi-Key; ComponentLink2Description: https://datasheet.ciiva.com/2454/pyu-r-int-thick-7-2454469.pdf?src-supplier=Digi-Key; ComponentLink3URL: https://datasheet.ciiva.com/2454/pyu-r-int-thick-7-2454470.pdf?src-supplier=Digi-Key; ComponentLink3Description: https://datasheet.ciiva.com/2454/pyu-r-int-thick-7-2454470.pdf?src-supplier=Digi-Key; ComponentLink4URL: https://datasheet.ciiva.com/15189/getdatasheetpartid-325160-15189622.pdf?src-supplier=Verical; ComponentLink4Description: https://datasheet.ciiva.com/15189/getdatasheetpartid-325160-15189622.pdf?src-supplier=Verical; ComponentLink5URL: https://datasheet.ciiva.com/7746/443971-7746266.pdf?src-supplier=Element14; ComponentLink5Description: https://datasheet.ciiva.com/7746/443971-7746266.pdf?src-supplier=Element14; ComponentLink6URL: https://datasheet.ciiva.com/7746/443971-7746267.pdf?src-supplier=Element14; ComponentLink6Description: https://datasheet.ciiva.com/7746/443971-7746267.pdf?src-supplier=Element14
R10 = CMP-2100-03667-1: Chip Resistor, 0 Ohm, +/- 5%, 0.1 W, -55 to 155 degC, 0603 (1608 Metric), RoHS, Tape and Reel; Manufacturer: Yageo; Manufacturer Part Number: RC0603JR-070RL; Temperature Coefficient: 200ppm/degreesC; Voltage Rating: 50V; Power Rating: 100mW; Resistance: 0mOhm; Width: 0.8mm; Max Operating Temperature: 155degC; Tolerance: 5%; Package Reference: 0603; Height: 0.45mm; Depth: 0.8mm; Package Description: 2-Pin Surface Mount Device, Body 1.6 x 0.8 mm; Termination: SMD/SMT; Package Quantity: 5000; Case/Package: 0603; Case Code (Imperial): 0603; Radiation Hardening: No; Number of Pins: 2; Length: 1.6mm; Lead Free: LeadFree; Voltage Rating (DC): 50V; Military Standard: Not; Datasheet URL: http://www.yageo.com/NewPortal/yageodocoutput?fileName=/pdf/R-Chip/PYu-RC_Group_51_RoHS_L_5.pdf; Manufacturer URL: http://www.yageo.com/; Packaging: TapeandReel; Case Code (Metric): 1608; Min Operating Temperature: -55degC; Composition: ThickFilm; RoHSCompliant: true; Contact Plating: Tin; Datasheet Version: Rev. 5, 10/2016; REACH SVHC: NoSVHC; Supplier 1: Avnet; Supplier Part Number 1: RC0603JR-070RL; RoHS: Yes; Category: Chip SMD Resistors; Stock 1: 1330000; Pricing 1: 5000=0.00138, 10000=0.00136, 20000=0.00132, 30000=0.00129, 40000=0.00124, 50000=0.00121, 500000=0.00118 (USD); Size Code: 0603; Resistor Type: Thick Film; Series: RC; Max Power Dissipation: 100mW; Construction: Rectangular; Number of Terminations: 2; Features: Moisture Resistant; Technology: THICK FILM; Resistance Tolerance: 5%; RoHS Compliant: Yes; ComponentLink1URL: https://datasheet.ciiva.com/11808/pyu-r-int-6-11808700.pdf?src-supplier=RSComponents; ComponentLink1Description: https://datasheet.ciiva.com/11808/pyu-r-int-6-11808700.pdf?src-supplier=RSComponents; ComponentLink2URL: https://datasheet.ciiva.com/22747/443971-22747530.pdf?src-supplier=Element14; ComponentLink2Description: https://datasheet.ciiva.com/22747/443971-22747530.pdf?src-supplier=Element14; ComponentLink3URL: https://datasheet.ciiva.com/12555/rc0603-272842-12555254.pdf?src-supplier=Mouser; ComponentLink3Description: https://datasheet.ciiva.com/12555/rc0603-272842-12555254.pdf?src-supplier=Mouser; ComponentLink4URL: https://datasheet.ciiva.com/7746/1738695-7746421.pdf?src-supplier=Element14; ComponentLink4Description: https://datasheet.ciiva.com/7746/1738695-7746421.pdf?src-supplier=Element14; ComponentLink5URL: https://datasheet.ciiva.com/7746/1738695-7746422.pdf?src-supplier=Element14; ComponentLink5Description: https://datasheet.ciiva.com/7746/1738695-7746422.pdf?src-supplier=Element14; ComponentLink6URL: https://datasheet.ciiva.com/8883/pyu-rc0603-51-rohs-l-4-8883045.pdf?src-supplier=Avnet; ComponentLink6Description: https://datasheet.ciiva.com/8883/pyu-rc0603-51-rohs-l-4-8883045.pdf?src-supplier=Avnet; ComponentLink7URL: https://datasheet.ciiva.com/15189/getdatasheetpartid-329462-15189845.pdf?src-supplier=Verical; ComponentLink7Description: https://datasheet.ciiva.com/15189/getdatasheetpartid-329462-15189845.pdf?src-supplier=Verical
R11 = CMP-2000-00279-1: RES, 16K5, 1%, 0.1W, 0603, THICK FILM; Manufacturer: Panasonic; Part Number: ERJ-3EKF1652V; Manufacturer Part Number: ERJ3EKF1652V; Resistance: 16.5kR; Temperature Coefficient: 100ppm/°C; Voltage Rating (DC): 50V; Power Rating: 100mW; Voltage Rating: 75V; Supplier 1: Digi-Key; Supplier Part Number 1: P16.5KHCT-ND; RoHS: Yes; Category: Chip SMD Resistors; Stock 1: 32109; Pricing 1: 1=0.10000, 10=0.05900, 100=0.02400, 1000=0.01079, 2500=0.00936 (USD); Mount: Surface Mount; Case/Package: 0603; Case Code (Metric): 1608; Case Code (Imperial): 0603; Contact Plating: Tin; Min Operating Temperature: -55°C; Max Operating Temperature: 155°C; Packaging: Tape and Reel; Tolerance: 1%; Resistor Type: Thick Film; Number of Terminations: 2; Max Power Dissipation: 100mW; Series: ERJ; Package Quantity: 5000; Termination: SMD/SMT; Features: Automotive AEC-Q200; Resistance Tolerance: 1%; Construction: Rectangular; Length: 1.6mm; Width: 0.031inch; Height: 0.022inch; Depth: 0.8mm; Radiation Hardening: No; RoHS Compliant: Yes; Lead Free: Lead Free; REACH SVHC: Unknown; Military Standard: Not; ComponentLink1URL: https://datasheet.ciiva.com/34303/1987679-34303576.pdf?src-supplier=Jameco; ComponentLink1Description: https://datasheet.ciiva.com/34303/1987679-34303576.pdf?src-supplier=Jameco; ComponentLink2URL: https://datasheet.ciiva.com/28695/1678782-28695960.pdf?src-supplier=Element14; ComponentLink2Description: https://datasheet.ciiva.com/28695/1678782-28695960.pdf?src-supplier=Element14; ComponentLink3URL: https://datasheet.ciiva.com/46389/426256-46389224.pdf?src-supplier=Element14; ComponentLink3Description: https://datasheet.ciiva.com/46389/426256-46389224.pdf?src-supplier=Element14; ComponentLink4URL: https://datasheet.ciiva.com/48531/aoa0000ce2-48531052.pdf?src-supplier=Avnet; ComponentLink4Description: https://datasheet.ciiva.com/48531/aoa0000ce2-48531052.pdf?src-supplier=Avnet; ComponentLink5URL: https://datasheet.ciiva.com/9192/aoa0000ce2-9192686.pdf?src-supplier=Avnet; ComponentLink5Description: https://datasheet.ciiva.com/9192/aoa0000ce2-9192686.pdf?src-supplier=Avnet; ComponentLink6URL: https://datasheet.ciiva.com/16767/70260748-16767022.pdf?src-supplier=Allied+Electronics; ComponentLink6Description: https://datasheet.ciiva.com/16767/70260748-16767022.pdf?src-supplier=Allied+Electronics
R33 = CMP-1012-00623-3: Chip Resistor, 10 KOhm, +/- 1%, 0.1 W, -55 to 155 degC, 0603 (1608 Metric), RoHS, Tape and Reel; Manufacturer: Panasonic; Manufacturer Part Number: ERJ-3EKF1002V; Voltage Rating: 75V; Case\/Package: 0603; Power Rating: 100mW; Resistance: 10KOhm; Temperature Coefficient: 100ppm\/degreesC; Number of Pins: 2; Package Reference: 603; Depth: 0.8mm; Mount: SurfaceMount; Package Description: 2-Pin Surface Mount Device, Body 1.6 x 0.85 mm; Datasheet Version: 02/2017; Length: 1.6mm; Lead Free: LeadFree; Height: 0.45mm; Number of Terminations: 2; Max Power Dissipation: 100mW; Min Operating Temperature: -55degC; Datasheet URL: https://industrial.panasonic.com/cdbs/www-data/pdf/RDA0000/AOA0000C304.pdf; Termination: SMD/SMT; Case Code (Metric): 1608; Case Code (Imperial): 0603; Tolerance: 1%; Max Operating Temperature: 155degC; RoHSCompliant: true; Voltage Rating (DC): 75V; Radiation Hardening: No; Packaging: TapeandReel; Composition: ThickFilm; Mounting Technology: SurfaceMount; Manufacturer URL: http://www.panasonic.com/; Width: 0.031inch; REACH SVHC: NoSVHC; Contact Plating: Tin; Military Standard: Not; Package Quantity: 1; Supplier 1: Newark; Supplier Part Number 1: 85Y8500; RoHS: Yes; Category: Chip SMD Resistors; Stock 1: 35659; Pricing 1: 10=0.60200, 25=0.39200, 50=0.27700, 100=0.15700, 250=0.13200, 500=0.10200, 1000=0.06200 (USD); Case/Package: 0603; Size Code: 0603; Series: ERJ; Resistance Tolerance: 1%; Resistor Type: Thick Film; Construction: Rectangular; Features: Automotive AEC-Q200; Technology: THICK FILM; RoHS Compliant: Yes; ComponentLink1URL: https://datasheet.ciiva.com/16511/aoa0000ce2-16511861.pdf?src-supplier=Avnet+Asia; ComponentLink1Description: https://datasheet.ciiva.com/16511/aoa0000ce2-16511861.pdf?src-supplier=Avnet+Asia; ComponentLink2URL: https://datasheet.ciiva.com/46372/1678782-46372725.pdf?src-supplier=Element14; ComponentLink2Description: https://datasheet.ciiva.com/46372/1678782-46372725.pdf?src-supplier=Element14; ComponentLink3URL: https://datasheet.ciiva.com/28514/426256-28514198.pdf?src-supplier=Element14; ComponentLink3Description: https://datasheet.ciiva.com/28514/426256-28514198.pdf?src-supplier=Element14; ComponentLink4URL: https://datasheet.ciiva.com/9194/aoa0000ce2-9194199.pdf?src-supplier=Avnet; ComponentLink4Description: https://datasheet.ciiva.com/9194/aoa0000ce2-9194199.pdf?src-supplier=Avnet; ComponentLink5URL: https://datasheet.ciiva.com/7830/aoa0000ce2-7830729.pdf?src-supplier=Element14; ComponentLink5Description: https://datasheet.ciiva.com/7830/aoa0000ce2-7830729.pdf?src-supplier=Element14; ComponentLink6URL: https://datasheet.ciiva.com/17212/aoa0000ce2-17212105.pdf?src-supplier=Avnet+Europe; ComponentLink6Description: https://datasheet.ciiva.com/17212/aoa0000ce2-17212105.pdf?src-supplier=Avnet+Europe; ComponentLink7URL: https://datasheet.ciiva.com/30208/aoa0000ce2-30208985.pdf?src-supplier=Onlinecomponents.com; ComponentLink7Description: https://datasheet.ciiva.com/30208/aoa0000ce2-30208985.pdf?src-supplier=Onlinecomponents.com; ComponentLink8URL: https://datasheet.ciiva.com/48530/aoa0000ce2-48530988.pdf?src-supplier=Avnet; ComponentLink8Description: https://datasheet.ciiva.com/48530/aoa0000ce2-48530988.pdf?src-supplier=Avnet; ComponentLink9URL: https://datasheet.ciiva.com/24070/aoa0000ce2-24070318.pdf?src-supplier=Mouser; ComponentLink9Description: https://datasheet.ciiva.com/24070/aoa0000ce2-24070318.pdf?src-supplier=Mouser; ComponentLink10URL: https://datasheet.ciiva.com/16759/70260748-16759807.pdf?src-supplier=Allied+Electronics; ComponentLink10Description: https://datasheet.ciiva.com/16759/70260748-16759807.pdf?src-supplier=Allied+Electronics
R69 = CMP-2000-00581-1: Manufacturer: Panasonic; Part Number: ERJ-3EKF5902V; Max Power Dissipation: 100mW; Resistance: 59kR; Tolerance: 1%; Voltage Rating: 75V; Temperature Coefficient: 100ppm/°C; Voltage Rating (DC): 50V; Supplier 1: Digi-Key; Supplier Part Number 1: P59.0KHCT-ND; Manufacturer Part Number: ERJ-3EKF5902V; RoHS: Yes; Category: Chip SMD Resistors; Stock 1: 43692; Pricing 1: 1=0.10000, 10=0.03700, 100=0.01490, 1000=0.00670, 2500=0.00582 (USD); Mount: Surface Mount; Case/Package: 0603; Contact Plating: Tin; Case Code (Metric): 1608; Case Code (Imperial): 0603; Min Operating Temperature: -55°C; Max Operating Temperature: 155°C; Packaging: Tape and Reel; Series: ERJ; Power Rating: 100mW; Package Quantity: 1; Resistor Type: Thick Film; Number of Terminations: 2; Resistance Tolerance: 1%; Features: Automotive AEC-Q200; Construction: Rectangular; Termination: SMD/SMT; Length: 1.6mm; Width: 0.031inch; Height: 0.022inch; Depth: 0.8mm; Radiation Hardening: No; REACH SVHC: No SVHC; RoHS Compliant: Yes; Lead Free: Lead Free; Military Standard: Not; ComponentLink1URL: https://datasheet.ciiva.com/3883/3984280s8821682n1386-3883650.pdf?src-supplier=Arrow+Electronics; ComponentLink1Description: https://datasheet.ciiva.com/3883/3984280s8821682n1386-3883650.pdf?src-supplier=Arrow+Electronics; ComponentLink2URL: https://datasheet.ciiva.com/22668/1678782-22668677.pdf?src-supplier=Element14; ComponentLink2Description: https://datasheet.ciiva.com/22668/1678782-22668677.pdf?src-supplier=Element14; ComponentLink3URL: https://datasheet.ciiva.com/28548/1694929-28548533.pdf?src-supplier=Element14; ComponentLink3Description: https://datasheet.ciiva.com/28548/1694929-28548533.pdf?src-supplier=Element14; ComponentLink4URL: https://datasheet.ciiva.com/7937/aoa0000ce2-7937446.pdf?src-supplier=Element14; ComponentLink4Description: https://datasheet.ciiva.com/7937/aoa0000ce2-7937446.pdf?src-supplier=Element14; ComponentLink5URL: https://datasheet.ciiva.com/46420/1678782-46420088.pdf?src-supplier=Element14; ComponentLink5Description: https://datasheet.ciiva.com/46420/1678782-46420088.pdf?src-supplier=Element14; ComponentLink6URL: https://datasheet.ciiva.com/16776/70260748-16776569.pdf?src-supplier=Allied+Electronics; ComponentLink6Description: https://datasheet.ciiva.com/16776/70260748-16776569.pdf?src-supplier=Allied+Electronics; ComponentLink7URL: https://datasheet.ciiva.com/30243/aoa0000ce2-30243289.pdf?src-supplier=Onlinecomponents.com; ComponentLink7Description: https://datasheet.ciiva.com/30243/aoa0000ce2-30243289.pdf?src-supplier=Onlinecomponents.com; ComponentLink8URL: https://datasheet.ciiva.com/24069/aoa0000ce2-24069402.pdf?src-supplier=Mouser; ComponentLink8Description: https://datasheet.ciiva.com/24069/aoa0000ce2-24069402.pdf?src-supplier=Mouser; ComponentLink9URL: https://datasheet.ciiva.com/17209/aoa0000ce2-17209116.pdf?src-supplier=Avnet+Europe; ComponentLink9Description: https://datasheet.ciiva.com/17209/aoa0000ce2-17209116.pdf?src-supplier=Avnet+Europe; ComponentLink10URL: https://datasheet.ciiva.com/9188/aoa0000ce2-9188557.pdf?src-supplier=Avnet; ComponentLink10Description: https://datasheet.ciiva.com/9188/aoa0000ce2-9188557.pdf?src-supplier=Avnet; ComponentLink11URL: https://datasheet.ciiva.com/16765/70260748-16765101.pdf?src-supplier=Allied+Electronics; ComponentLink11Description: https://datasheet.ciiva.com/16765/70260748-16765101.pdf?src-supplier=Allied+Electronics; ComponentLink12URL: https://datasheet.ciiva.com/16514/aoa0000ce2-16514127.pdf?src-supplier=Avnet+Asia; ComponentLink12Description: https://datasheet.ciiva.com/16514/aoa0000ce2-16514127.pdf?src-supplier=Avnet+Asia
R70 = CMP-2000-03423-1: Manufacturer: Vishay Dale; Part Number: CRCW06034K99FKTA; Resistance: 4.99kR; Power Rating: 100mW; Temperature Coefficient: 100ppm/°C; Tolerance: 1%; Voltage Rating: 75V; Supplier 1: Newark; Supplier Part Number 1: 15AC2497; Manufacturer Part Number: CRCW06034K99FKTA; RoHS: No; Category: Chip SMD Resistors; Stock 1: 75000; Pricing 1: 5000=0.02600 (USD); Case/Package: 0603; Number of Pins: 2; Case Code (Metric): 1608; Case Code (Imperial): 0603; Contact Plating: Tin,Lead; Weight: 7.1E-05oz; Size Code: 0603; Min Operating Temperature: -55°C; Max Operating Temperature: 155°C; Packaging: Tape and Reel; Resistor Type: Thick Film; Number of Terminations: 2; Max Power Dissipation: 100mW; Series: CRCW; Package Quantity: 5000; Voltage Rating (DC): 75V; Termination: SMD/SMT; Features: Automotive AEC-Q200; Resistance Tolerance: 1%; Construction: Rectangular; Power Dissipation: 100mW; Length: 1.55mm; Width: 0.033inch; Height: 0.02inch; Depth: 0.85mm; Radiation Hardening: No; RoHS Compliant: No; Lead Free: Contains Lead; Military Standard: Not; ComponentLink1URL: https://datasheet.ciiva.com/2565/dcrcw-2565429.pdf?src-supplier=Digi-Key; ComponentLink1Description: https://datasheet.ciiva.com/2565/dcrcw-2565429.pdf?src-supplier=Digi-Key; ComponentLink2URL: https://datasheet.ciiva.com/16494/dcrcw-16494469.pdf?src-supplier=Future+Electronics; ComponentLink2Description: https://datasheet.ciiva.com/16494/dcrcw-16494469.pdf?src-supplier=Future+Electronics; ComponentLink3URL: https://datasheet.ciiva.com/3257/dcrcw-3257675.pdf?src-supplier=Avnet; ComponentLink3Description: https://datasheet.ciiva.com/3257/dcrcw-3257675.pdf?src-supplier=Avnet; ComponentLink4URL: https://datasheet.ciiva.com/3257/dcrcw-3257676.pdf?src-supplier=Avnet; ComponentLink4Description: https://datasheet.ciiva.com/3257/dcrcw-3257676.pdf?src-supplier=Avnet
R89 R102 = CMP-2003-02667-1: Manufacturer: Susumu; Part Number: RG3216P-1002-B-T5